# Altium schematic sheet 74HC14D,653.schdoc
size 49 x 46 mm
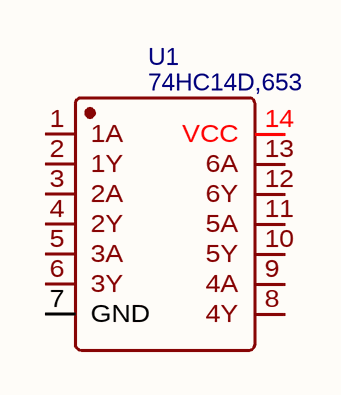
[diagram p0: 74HC14D,653.schdoc]

## Parts
U1  74HC14D,653  [SOIC-14_L8.7-W3.9-P1.27-LS6.0-BL]

## Nets

Not connected (* = marked no-connect by the designer): U1 1(1A) 2(1Y) 3(2A) 4(2Y) 5(3A) 6(3Y) 7(GND) 8(4Y) 9(4A) 10(5Y) 11(5A) 12(6Y) 13(6A) 14(VCC)

## Library data of the parts
U1 = 74HC14D,653: Manufacturer: Nexperia(安世); spicePre: X; Supplier: LCSC; Manufacturer Part: 74HC14D,653; Supplier Part: C5605; JLCPCB Part Class: Basic Part; spiceSymbolName: 74HC14D,653